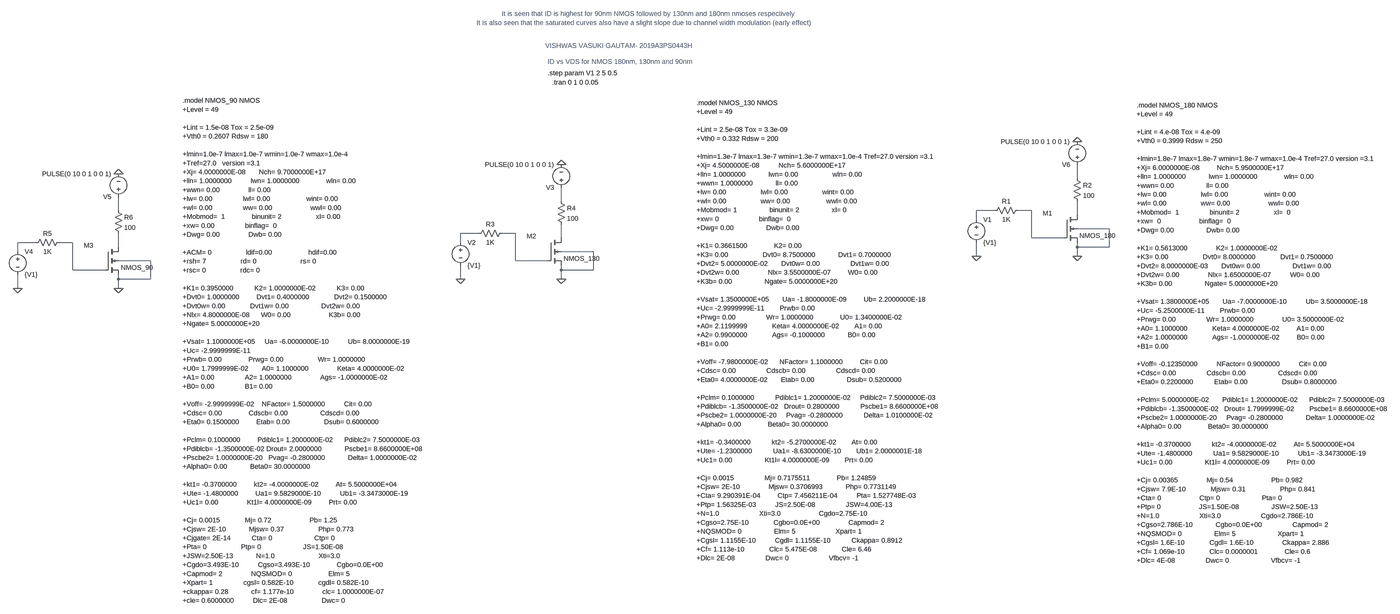
[diagram p0: schematic NMOS_IDvsVDS.asc, whole sheet]
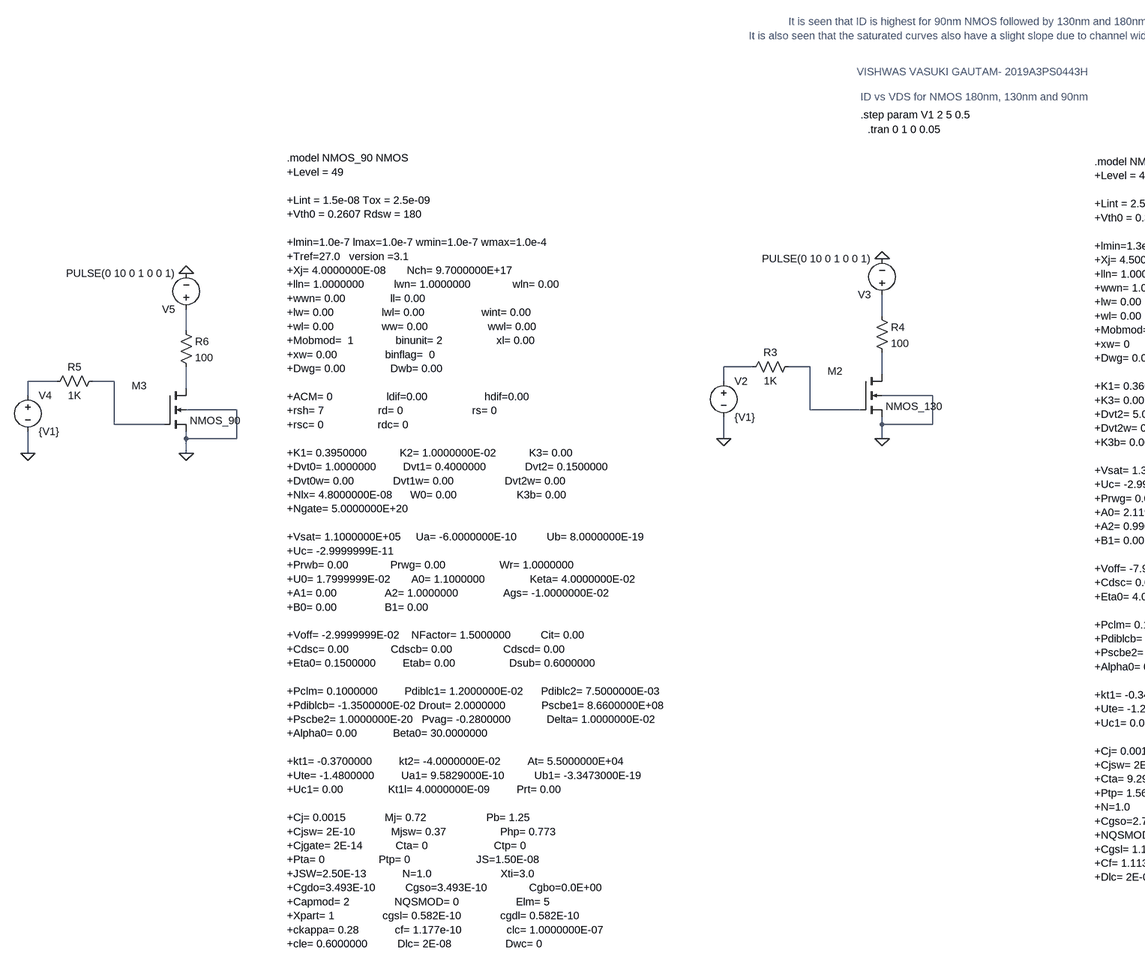
[diagram p1: schematic NMOS_IDvsVDS.asc, part, row 1 of 1, column 1 of 2]
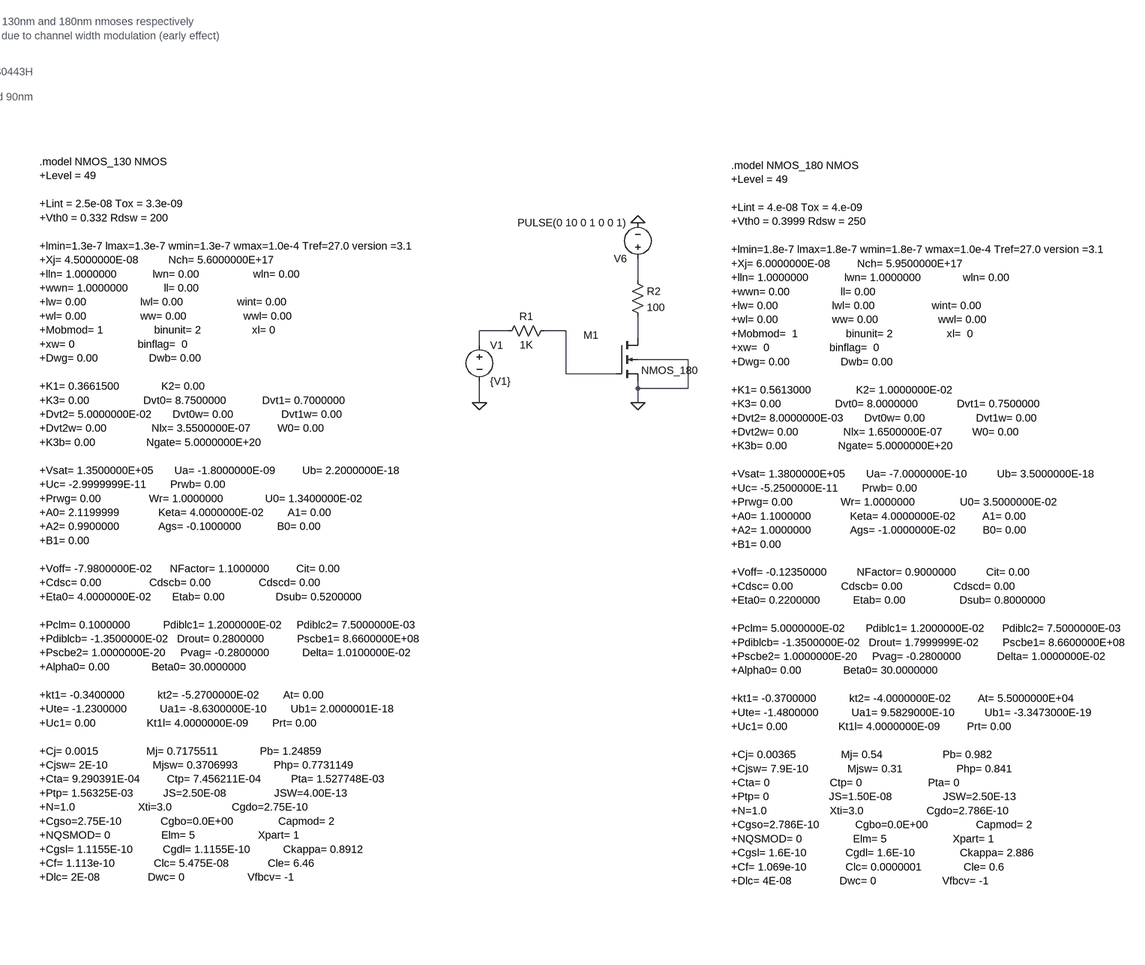
[diagram p2: schematic NMOS_IDvsVDS.asc, part, row 1 of 1, column 2 of 2]
NMOS_IDvsVDS.asc, the LTspice schematic file:
Version 4
SHEET 1 2132 1312
WIRE 912 0 912 -48
WIRE -1040 80 -1040 32
WIRE -3040 112 -3040 64
WIRE 624 112 560 112
WIRE 752 112 704 112
WIRE 912 128 912 80
WIRE 560 144 560 112
WIRE 1024 176 912 176
WIRE -1328 192 -1392 192
WIRE -1200 192 -1248 192
WIRE -1040 208 -1040 160
WIRE 752 208 752 112
WIRE 864 208 752 208
WIRE -3328 224 -3392 224
WIRE -3200 224 -3248 224
WIRE -1392 224 -1392 192
WIRE -3040 240 -3040 192
WIRE 912 240 912 224
WIRE 1024 240 1024 176
WIRE 1024 240 912 240
WIRE -3392 256 -3392 224
WIRE -928 256 -1040 256
WIRE 560 272 560 224
WIRE 912 272 912 240
WIRE -2928 288 -3040 288
WIRE -1200 288 -1200 192
WIRE -1088 288 -1200 288
WIRE -3200 320 -3200 224
WIRE -3088 320 -3200 320
WIRE -1040 320 -1040 304
WIRE -928 320 -928 256
WIRE -928 320 -1040 320
WIRE -3040 352 -3040 336
WIRE -2928 352 -2928 288
WIRE -2928 352 -3040 352
WIRE -1392 352 -1392 304
WIRE -1040 352 -1040 320
WIRE -3392 384 -3392 336
WIRE -3040 384 -3040 352
FLAG 912 272 0
FLAG 560 272 0
FLAG -1040 352 0
FLAG -1392 352 0
FLAG -3040 384 0
FLAG -3392 384 0
FLAG 912 -128 0
FLAG -1040 -48 0
FLAG -3040 -16 0
SYMBOL res 720 96 R90
WINDOW 0 0 56 VBottom 2
WINDOW 3 32 56 VTop 2
SYMATTR InstName R1
SYMATTR Value 1K
SYMBOL res 896 -16 R0
SYMATTR InstName R2
SYMATTR Value 100
SYMBOL voltage 560 128 R0
WINDOW 123 0 0 Left 2
WINDOW 39 0 0 Left 2
SYMATTR InstName V1
SYMATTR Value {V1}
SYMBOL nmos4 864 128 R0
WINDOW 0 -73 -6 Left 2
SYMATTR InstName M1
SYMATTR Value NMOS_180
SYMATTR Value2 l=0.5u w=10u
SYMBOL res -1232 176 R90
WINDOW 0 0 56 VBottom 2
WINDOW 3 32 56 VTop 2
SYMATTR InstName R3
SYMATTR Value 1K
SYMBOL res -1056 64 R0
SYMATTR InstName R4
SYMATTR Value 100
SYMBOL voltage -1392 208 R0
WINDOW 123 0 0 Left 2
WINDOW 39 0 0 Left 2
SYMATTR InstName V2
SYMATTR Value {V1}
SYMBOL voltage -1040 48 R180
WINDOW 123 0 0 Left 2
WINDOW 39 0 0 Left 2
SYMATTR InstName V3
SYMATTR Value PULSE(0 10 0 1 0 0 1)
SYMBOL nmos4 -1088 208 R0
WINDOW 0 -73 -6 Left 2
SYMATTR InstName M2
SYMATTR Value NMOS_130
SYMATTR Value2 l=0.5u w=10u
SYMBOL res -3232 208 R90
WINDOW 0 0 56 VBottom 2
WINDOW 3 32 56 VTop 2
SYMATTR InstName R5
SYMATTR Value 1K
SYMBOL res -3056 96 R0
SYMATTR InstName R6
SYMATTR Value 100
SYMBOL voltage -3392 240 R0
WINDOW 123 0 0 Left 2
WINDOW 39 0 0 Left 2
SYMATTR InstName V4
SYMATTR Value {V1}
SYMBOL voltage -3040 80 R180
WINDOW 123 0 0 Left 2
WINDOW 39 0 0 Left 2
SYMATTR InstName V5
SYMATTR Value PULSE(0 10 0 1 0 0 1)
SYMBOL nmos4 -3088 240 R0
WINDOW 0 -73 -6 Left 2
SYMATTR InstName M3
SYMATTR Value NMOS_90
SYMATTR Value2 l=0.5u w=10u
SYMBOL voltage 912 -32 R180
WINDOW 123 0 0 Left 2
WINDOW 39 0 0 Left 2
SYMATTR InstName V6
SYMATTR Value PULSE(0 10 0 1 0 0 1)
TEXT -1072 -336 Left 2 !.tran 0 1 0 0.05
TEXT -1088 -368 Left 2 !.step param V1 2 5 0.5
TEXT -1088 -408 Left 2 ;ID vs VDS for NMOS 180nm, 130nm and 90nm
TEXT 1120 -256 Left 2 !.model NMOS_180 NMOS\n+Level = 49\n \n+Lint = 4.e-08 Tox = 4.e-09 \n+Vth0 = 0.3999 Rdsw = 250 \n \n+lmin=1.8e-7 lmax=1.8e-7 wmin=1.8e-7 wmax=1.0e-4 Tref=27.0 version =3.1\n+Xj= 6.0000000E-08         Nch= 5.9500000E+17 \n+lln= 1.0000000            lwn= 1.0000000              wln= 0.00\n+wwn= 0.00                 ll= 0.00\n+lw= 0.00                  lwl= 0.00                   wint= 0.00\n+wl= 0.00                  ww= 0.00                    wwl= 0.00\n+Mobmod=  1                binunit= 2                  xl=  0\n+xw=  0                    binflag=  0\n+Dwg= 0.00                 Dwb= 0.00 \n \n+K1= 0.5613000               K2= 1.0000000E-02 \n+K3= 0.00                  Dvt0= 8.0000000             Dvt1= 0.7500000 \n+Dvt2= 8.0000000E-03       Dvt0w= 0.00                 Dvt1w= 0.00 \n+Dvt2w= 0.00               Nlx= 1.6500000E-07          W0= 0.00 \n+K3b= 0.00                 Ngate= 5.0000000E+20 \n \n+Vsat= 1.3800000E+05       Ua= -7.0000000E-10          Ub= 3.5000000E-18 \n+Uc= -5.2500000E-11        Prwb= 0.00 \n+Prwg= 0.00                Wr= 1.0000000               U0= 3.5000000E-02 \n+A0= 1.1000000             Keta= 4.0000000E-02         A1= 0.00 \n+A2= 1.0000000             Ags= -1.0000000E-02         B0= 0.00 \n+B1= 0.00 \n \n+Voff= -0.12350000          NFactor= 0.9000000          Cit= 0.00 \n+Cdsc= 0.00                Cdscb= 0.00                 Cdscd= 0.00 \n+Eta0= 0.2200000           Etab= 0.00                  Dsub= 0.8000000 \n \n+Pclm= 5.0000000E-02       Pdiblc1= 1.2000000E-02      Pdiblc2= 7.5000000E-03 \n+Pdiblcb= -1.3500000E-02   Drout= 1.7999999E-02        Pscbe1= 8.6600000E+08 \n+Pscbe2= 1.0000000E-20     Pvag= -0.2800000            Delta= 1.0000000E-02 \n+Alpha0= 0.00              Beta0= 30.0000000 \n \n+kt1= -0.3700000           kt2= -4.0000000E-02         At= 5.5000000E+04 \n+Ute= -1.4800000           Ua1= 9.5829000E-10          Ub1= -3.3473000E-19 \n+Uc1= 0.00                 Kt1l= 4.0000000E-09         Prt= 0.00 \n \n+Cj= 0.00365               Mj= 0.54                    Pb= 0.982\n+Cjsw= 7.9E-10             Mjsw= 0.31                  Php= 0.841\n+Cta= 0                    Ctp= 0                      Pta= 0\n+Ptp= 0                    JS=1.50E-08                 JSW=2.50E-13\n+N=1.0                     Xti=3.0                     Cgdo=2.786E-10\n+Cgso=2.786E-10            Cgbo=0.0E+00                Capmod= 2\n+NQSMOD= 0                 Elm= 5                      Xpart= 1\n+Cgsl= 1.6E-10             Cgdl= 1.6E-10               Ckappa= 2.886\n+Cf= 1.069e-10             Clc= 0.0000001              Cle= 0.6\n+Dlc= 4E-08                Dwc= 0                      Vfbcv= -1
TEXT -568 -264 Left 2 !.model NMOS_130 NMOS\n+Level = 49\n \n+Lint = 2.5e-08 Tox = 3.3e-09 \n+Vth0 = 0.332 Rdsw = 200 \n \n+lmin=1.3e-7 lmax=1.3e-7 wmin=1.3e-7 wmax=1.0e-4 Tref=27.0 version =3.1\n+Xj= 4.5000000E-08          Nch= 5.6000000E+17 \n+lln= 1.0000000            lwn= 0.00                  wln= 0.00\n+wwn= 1.0000000            ll= 0.00\n+lw= 0.00                  lwl= 0.00                  wint= 0.00\n+wl= 0.00                  ww= 0.00                   wwl= 0.00\n+Mobmod= 1                 binunit= 2                 xl= 0\n+xw= 0                     binflag=  0\n+Dwg= 0.00                 Dwb= 0.00 \n \n+K1= 0.3661500              K2= 0.00 \n+K3= 0.00                  Dvt0= 8.7500000            Dvt1= 0.7000000 \n+Dvt2= 5.0000000E-02       Dvt0w= 0.00                Dvt1w= 0.00 \n+Dvt2w= 0.00               Nlx= 3.5500000E-07         W0= 0.00 \n+K3b= 0.00                 Ngate= 5.0000000E+20 \n \n+Vsat= 1.3500000E+05       Ua= -1.8000000E-09         Ub= 2.2000000E-18 \n+Uc= -2.9999999E-11        Prwb= 0.00 \n+Prwg= 0.00                Wr= 1.0000000              U0= 1.3400000E-02 \n+A0= 2.1199999             Keta= 4.0000000E-02        A1= 0.00 \n+A2= 0.9900000             Ags= -0.1000000            B0= 0.00 \n+B1= 0.00 \n \n+Voff= -7.9800000E-02      NFactor= 1.1000000         Cit= 0.00 \n+Cdsc= 0.00                Cdscb= 0.00                Cdscd= 0.00 \n+Eta0= 4.0000000E-02       Etab= 0.00                 Dsub= 0.5200000 \n \n+Pclm= 0.1000000           Pdiblc1= 1.2000000E-02     Pdiblc2= 7.5000000E-03 \n+Pdiblcb= -1.3500000E-02   Drout= 0.2800000           Pscbe1= 8.6600000E+08 \n+Pscbe2= 1.0000000E-20     Pvag= -0.2800000           Delta= 1.0100000E-02 \n+Alpha0= 0.00              Beta0= 30.0000000 \n \n+kt1= -0.3400000           kt2= -5.2700000E-02        At= 0.00 \n+Ute= -1.2300000           Ua1= -8.6300000E-10        Ub1= 2.0000001E-18 \n+Uc1= 0.00                 Kt1l= 4.0000000E-09        Prt= 0.00 \n \n+Cj= 0.0015                Mj= 0.7175511              Pb= 1.24859\n+Cjsw= 2E-10               Mjsw= 0.3706993            Php= 0.7731149\n+Cta= 9.290391E-04         Ctp= 7.456211E-04          Pta= 1.527748E-03\n+Ptp= 1.56325E-03          JS=2.50E-08                JSW=4.00E-13\n+N=1.0                     Xti=3.0                    Cgdo=2.75E-10\n+Cgso=2.75E-10             Cgbo=0.0E+00               Capmod= 2\n+NQSMOD= 0                 Elm= 5                     Xpart= 1\n+Cgsl= 1.1155E-10          Cgdl= 1.1155E-10           Ckappa= 0.8912\n+Cf= 1.113e-10             Clc= 5.475E-08             Cle= 6.46\n+Dlc= 2E-08                Dwc= 0                     Vfbcv= -1
TEXT -2776 -272 Left 2 !.model NMOS_90 NMOS\n+Level = 49\n \n+Lint = 1.5e-08 Tox = 2.5e-09 \n+Vth0 = 0.2607 Rdsw = 180 \n \n+lmin=1.0e-7 lmax=1.0e-7 wmin=1.0e-7 wmax=1.0e-4\n+Tref=27.0   version =3.1\n+Xj= 4.0000000E-08       Nch= 9.7000000E+17 \n+lln= 1.0000000          lwn= 1.0000000              wln= 0.00\n+wwn= 0.00               ll= 0.00\n+lw= 0.00                lwl= 0.00                   wint= 0.00\n+wl= 0.00                ww= 0.00                    wwl= 0.00\n+Mobmod=  1              binunit= 2                  xl= 0.00\n+xw= 0.00                binflag=  0\n+Dwg= 0.00               Dwb= 0.00 \n \n+ACM= 0                  ldif=0.00                   hdif=0.00\n+rsh= 7                  rd= 0                       rs= 0\n+rsc= 0                  rdc= 0\n \n+K1= 0.3950000           K2= 1.0000000E-02           K3= 0.00 \n+Dvt0= 1.0000000         Dvt1= 0.4000000             Dvt2= 0.1500000 \n+Dvt0w= 0.00             Dvt1w= 0.00                 Dvt2w= 0.00 \n+Nlx= 4.8000000E-08      W0= 0.00                    K3b= 0.00 \n+Ngate= 5.0000000E+20 \n \n+Vsat= 1.1000000E+05     Ua= -6.0000000E-10          Ub= 8.0000000E-19 \n+Uc= -2.9999999E-11       \n+Prwb= 0.00              Prwg= 0.00                  Wr= 1.0000000 \n+U0= 1.7999999E-02       A0= 1.1000000               Keta= 4.0000000E-02 \n+A1= 0.00                A2= 1.0000000               Ags= -1.0000000E-02\n+B0= 0.00                B1= 0.00 \n \n+Voff= -2.9999999E-02    NFactor= 1.5000000          Cit= 0.00 \n+Cdsc= 0.00              Cdscb= 0.00                 Cdscd= 0.00 \n+Eta0= 0.1500000         Etab= 0.00                  Dsub= 0.6000000 \n \n+Pclm= 0.1000000         Pdiblc1= 1.2000000E-02      Pdiblc2= 7.5000000E-03\n+Pdiblcb= -1.3500000E-02 Drout= 2.0000000            Pscbe1= 8.6600000E+08\n+Pscbe2= 1.0000000E-20   Pvag= -0.2800000            Delta= 1.0000000E-02\n+Alpha0= 0.00            Beta0= 30.0000000 \n \n+kt1= -0.3700000         kt2= -4.0000000E-02         At= 5.5000000E+04 \n+Ute= -1.4800000         Ua1= 9.5829000E-10          Ub1= -3.3473000E-19\n+Uc1= 0.00               Kt1l= 4.0000000E-09         Prt= 0.00 \n \n+Cj= 0.0015             Mj= 0.72                    Pb= 1.25 \n+Cjsw= 2E-10            Mjsw= 0.37                  Php= 0.773\n+Cjgate= 2E-14           Cta= 0                      Ctp= 0\n+Pta= 0                  Ptp= 0                      JS=1.50E-08\n+JSW=2.50E-13            N=1.0                       Xti=3.0\n+Cgdo=3.493E-10          Cgso=3.493E-10              Cgbo=0.0E+00\n+Capmod= 2               NQSMOD= 0                   Elm= 5\n+Xpart= 1                cgsl= 0.582E-10             cgdl= 0.582E-10\n+ckappa= 0.28            cf= 1.177e-10               clc= 1.0000000E-07\n+cle= 0.6000000          Dlc= 2E-08                  Dwc= 0
TEXT -1096 -464 Left 2 ;VISHWAS VASUKI GAUTAM- 2019A3PS0443H
TEXT -1248 -576 Left 2 ;It is seen that ID is highest for 90nm NMOS followed by 130nm and 180nm nmoses respectively
TEXT -1336 -544 Left 2 ;It is also seen that the saturated curves also have a slight slope due to channel width modulation (early effect)

The netlist it stands for:
* NMOS_IDvsVDS.asc
R1 N005 N004 1K
R2 N001 N006 100
V1 N004 0 {V1}
M1 N006 N005 0 0 NMOS_180 l=0.5u w=10u
R3 N008 N007 1K
R4 N002 N009 100
V2 N007 0 {V1}
V3 N002 0 PULSE(0 10 0 1 0 0 1)
M2 N009 N008 0 0 NMOS_130 l=0.5u w=10u
R5 N011 N010 1K
R6 N003 N012 100
V4 N010 0 {V1}
V5 N003 0 PULSE(0 10 0 1 0 0 1)
M3 N012 N011 0 0 NMOS_90 l=0.5u w=10u
V6 N001 0 PULSE(0 10 0 1 0 0 1)
.model NMOS NMOS
.model PMOS PMOS
.lib standard.mos
.tran 0 1 0 0.05
.step param V1 2 5 0.5
* ID vs VDS for NMOS 180nm, 130nm and 90nm
.model NMOS_180 NMOS
+Level = 49
+Lint = 4.e-08 Tox = 4.e-09
+Vth0 = 0.3999 Rdsw = 250
+lmin=1.8e-7 lmax=1.8e-7 wmin=1.8e-7 wmax=1.0e-4 Tref=27.0 version =3.1
+Xj= 6.0000000E-08         Nch= 5.9500000E+17
+lln= 1.0000000            lwn= 1.0000000              wln= 0.00
+wwn= 0.00                 ll= 0.00
+lw= 0.00                  lwl= 0.00                   wint= 0.00
+wl= 0.00                  ww= 0.00                    wwl= 0.00
+Mobmod=  1                binunit= 2                  xl=  0
+xw=  0                    binflag=  0
+Dwg= 0.00                 Dwb= 0.00
+K1= 0.5613000               K2= 1.0000000E-02
+K3= 0.00                  Dvt0= 8.0000000             Dvt1= 0.7500000
+Dvt2= 8.0000000E-03       Dvt0w= 0.00                 Dvt1w= 0.00
+Dvt2w= 0.00               Nlx= 1.6500000E-07          W0= 0.00
+K3b= 0.00                 Ngate= 5.0000000E+20
+Vsat= 1.3800000E+05       Ua= -7.0000000E-10          Ub= 3.5000000E-18
+Uc= -5.2500000E-11        Prwb= 0.00
+Prwg= 0.00                Wr= 1.0000000               U0= 3.5000000E-02
+A0= 1.1000000             Keta= 4.0000000E-02         A1= 0.00
+A2= 1.0000000             Ags= -1.0000000E-02         B0= 0.00
+B1= 0.00
+Voff= -0.12350000          NFactor= 0.9000000          Cit= 0.00
+Cdsc= 0.00                Cdscb= 0.00                 Cdscd= 0.00
+Eta0= 0.2200000           Etab= 0.00                  Dsub= 0.8000000
+Pclm= 5.0000000E-02       Pdiblc1= 1.2000000E-02      Pdiblc2= 7.5000000E-03
+Pdiblcb= -1.3500000E-02   Drout= 1.7999999E-02        Pscbe1= 8.6600000E+08
+Pscbe2= 1.0000000E-20     Pvag= -0.2800000            Delta= 1.0000000E-02
+Alpha0= 0.00              Beta0= 30.0000000
+kt1= -0.3700000           kt2= -4.0000000E-02         At= 5.5000000E+04
+Ute= -1.4800000           Ua1= 9.5829000E-10          Ub1= -3.3473000E-19
+Uc1= 0.00                 Kt1l= 4.0000000E-09         Prt= 0.00
+Cj= 0.00365               Mj= 0.54                    Pb= 0.982
+Cjsw= 7.9E-10             Mjsw= 0.31                  Php= 0.841
+Cta= 0                    Ctp= 0                      Pta= 0
+Ptp= 0                    JS=1.50E-08                 JSW=2.50E-13
+N=1.0                     Xti=3.0                     Cgdo=2.786E-10
+Cgso=2.786E-10            Cgbo=0.0E+00                Capmod= 2
+NQSMOD= 0                 Elm= 5                      Xpart= 1
+Cgsl= 1.6E-10             Cgdl= 1.6E-10               Ckappa= 2.886
+Cf= 1.069e-10             Clc= 0.0000001              Cle= 0.6
+Dlc= 4E-08                Dwc= 0                      Vfbcv= -1
.model NMOS_130 NMOS
+Level = 49
+Lint = 2.5e-08 Tox = 3.3e-09
+Vth0 = 0.332 Rdsw = 200
+lmin=1.3e-7 lmax=1.3e-7 wmin=1.3e-7 wmax=1.0e-4 Tref=27.0 version =3.1
+Xj= 4.5000000E-08          Nch= 5.6000000E+17
+lln= 1.0000000            lwn= 0.00                  wln= 0.00
+wwn= 1.0000000            ll= 0.00
+lw= 0.00                  lwl= 0.00                  wint= 0.00
+wl= 0.00                  ww= 0.00                   wwl= 0.00
+Mobmod= 1                 binunit= 2                 xl= 0
+xw= 0                     binflag=  0
+Dwg= 0.00                 Dwb= 0.00
+K1= 0.3661500              K2= 0.00
+K3= 0.00                  Dvt0= 8.7500000            Dvt1= 0.7000000
+Dvt2= 5.0000000E-02       Dvt0w= 0.00                Dvt1w= 0.00
+Dvt2w= 0.00               Nlx= 3.5500000E-07         W0= 0.00
+K3b= 0.00                 Ngate= 5.0000000E+20
+Vsat= 1.3500000E+05       Ua= -1.8000000E-09         Ub= 2.2000000E-18
+Uc= -2.9999999E-11        Prwb= 0.00
+Prwg= 0.00                Wr= 1.0000000              U0= 1.3400000E-02
+A0= 2.1199999             Keta= 4.0000000E-02        A1= 0.00
+A2= 0.9900000             Ags= -0.1000000            B0= 0.00
+B1= 0.00
+Voff= -7.9800000E-02      NFactor= 1.1000000         Cit= 0.00
+Cdsc= 0.00                Cdscb= 0.00                Cdscd= 0.00
+Eta0= 4.0000000E-02       Etab= 0.00                 Dsub= 0.5200000
+Pclm= 0.1000000           Pdiblc1= 1.2000000E-02     Pdiblc2= 7.5000000E-03
+Pdiblcb= -1.3500000E-02   Drout= 0.2800000           Pscbe1= 8.6600000E+08
+Pscbe2= 1.0000000E-20     Pvag= -0.2800000           Delta= 1.0100000E-02
+Alpha0= 0.00              Beta0= 30.0000000
+kt1= -0.3400000           kt2= -5.2700000E-02        At= 0.00
+Ute= -1.2300000           Ua1= -8.6300000E-10        Ub1= 2.0000001E-18
+Uc1= 0.00                 Kt1l= 4.0000000E-09        Prt= 0.00
+Cj= 0.0015                Mj= 0.7175511              Pb= 1.24859
+Cjsw= 2E-10               Mjsw= 0.3706993            Php= 0.7731149
+Cta= 9.290391E-04         Ctp= 7.456211E-04          Pta= 1.527748E-03
+Ptp= 1.56325E-03          JS=2.50E-08                JSW=4.00E-13
+N=1.0                     Xti=3.0                    Cgdo=2.75E-10
+Cgso=2.75E-10             Cgbo=0.0E+00               Capmod= 2
+NQSMOD= 0                 Elm= 5                     Xpart= 1
+Cgsl= 1.1155E-10          Cgdl= 1.1155E-10           Ckappa= 0.8912
+Cf= 1.113e-10             Clc= 5.475E-08             Cle= 6.46
+Dlc= 2E-08                Dwc= 0                     Vfbcv= -1
.model NMOS_90 NMOS
+Level = 49
+Lint = 1.5e-08 Tox = 2.5e-09
+Vth0 = 0.2607 Rdsw = 180
+lmin=1.0e-7 lmax=1.0e-7 wmin=1.0e-7 wmax=1.0e-4
+Tref=27.0   version =3.1
+Xj= 4.0000000E-08       Nch= 9.7000000E+17
+lln= 1.0000000          lwn= 1.0000000              wln= 0.00
+wwn= 0.00               ll= 0.00
+lw= 0.00                lwl= 0.00                   wint= 0.00
+wl= 0.00                ww= 0.00                    wwl= 0.00
+Mobmod=  1              binunit= 2                  xl= 0.00
+xw= 0.00                binflag=  0
+Dwg= 0.00               Dwb= 0.00
+ACM= 0                  ldif=0.00                   hdif=0.00
+rsh= 7                  rd= 0                       rs= 0
+rsc= 0                  rdc= 0
+K1= 0.3950000           K2= 1.0000000E-02           K3= 0.00
+Dvt0= 1.0000000         Dvt1= 0.4000000             Dvt2= 0.1500000
+Dvt0w= 0.00             Dvt1w= 0.00                 Dvt2w= 0.00
+Nlx= 4.8000000E-08      W0= 0.00                    K3b= 0.00
+Ngate= 5.0000000E+20
+Vsat= 1.1000000E+05     Ua= -6.0000000E-10          Ub= 8.0000000E-19
+Uc= -2.9999999E-11
+Prwb= 0.00              Prwg= 0.00                  Wr= 1.0000000
+U0= 1.7999999E-02       A0= 1.1000000               Keta= 4.0000000E-02
+A1= 0.00                A2= 1.0000000               Ags= -1.0000000E-02
+B0= 0.00                B1= 0.00
+Voff= -2.9999999E-02    NFactor= 1.5000000          Cit= 0.00
+Cdsc= 0.00              Cdscb= 0.00                 Cdscd= 0.00
+Eta0= 0.1500000         Etab= 0.00                  Dsub= 0.6000000
+Pclm= 0.1000000         Pdiblc1= 1.2000000E-02      Pdiblc2= 7.5000000E-03
+Pdiblcb= -1.3500000E-02 Drout= 2.0000000            Pscbe1= 8.6600000E+08
+Pscbe2= 1.0000000E-20   Pvag= -0.2800000            Delta= 1.0000000E-02
+Alpha0= 0.00            Beta0= 30.0000000
+kt1= -0.3700000         kt2= -4.0000000E-02         At= 5.5000000E+04
+Ute= -1.4800000         Ua1= 9.5829000E-10          Ub1= -3.3473000E-19
+Uc1= 0.00               Kt1l= 4.0000000E-09         Prt= 0.00
+Cj= 0.0015             Mj= 0.72                    Pb= 1.25
+Cjsw= 2E-10            Mjsw= 0.37                  Php= 0.773
+Cjgate= 2E-14           Cta= 0                      Ctp= 0
+Pta= 0                  Ptp= 0                      JS=1.50E-08
+JSW=2.50E-13            N=1.0                       Xti=3.0
+Cgdo=3.493E-10          Cgso=3.493E-10              Cgbo=0.0E+00
+Capmod= 2               NQSMOD= 0                   Elm= 5
+Xpart= 1                cgsl= 0.582E-10             cgdl= 0.582E-10
+ckappa= 0.28            cf= 1.177e-10               clc= 1.0000000E-07
+cle= 0.6000000          Dlc= 2E-08                  Dwc= 0
* VISHWAS VASUKI GAUTAM- 2019A3PS0443H
* It is seen that ID is highest for 90nm NMOS followed by 130nm and 180nm nmoses respectively
* It is also seen that the saturated curves also have a slight slope due to channel width modulation (early effect)
.backanno
.end